# EAGLE design LiPo Rider Pro v0.9b (EAGLE 5.10)
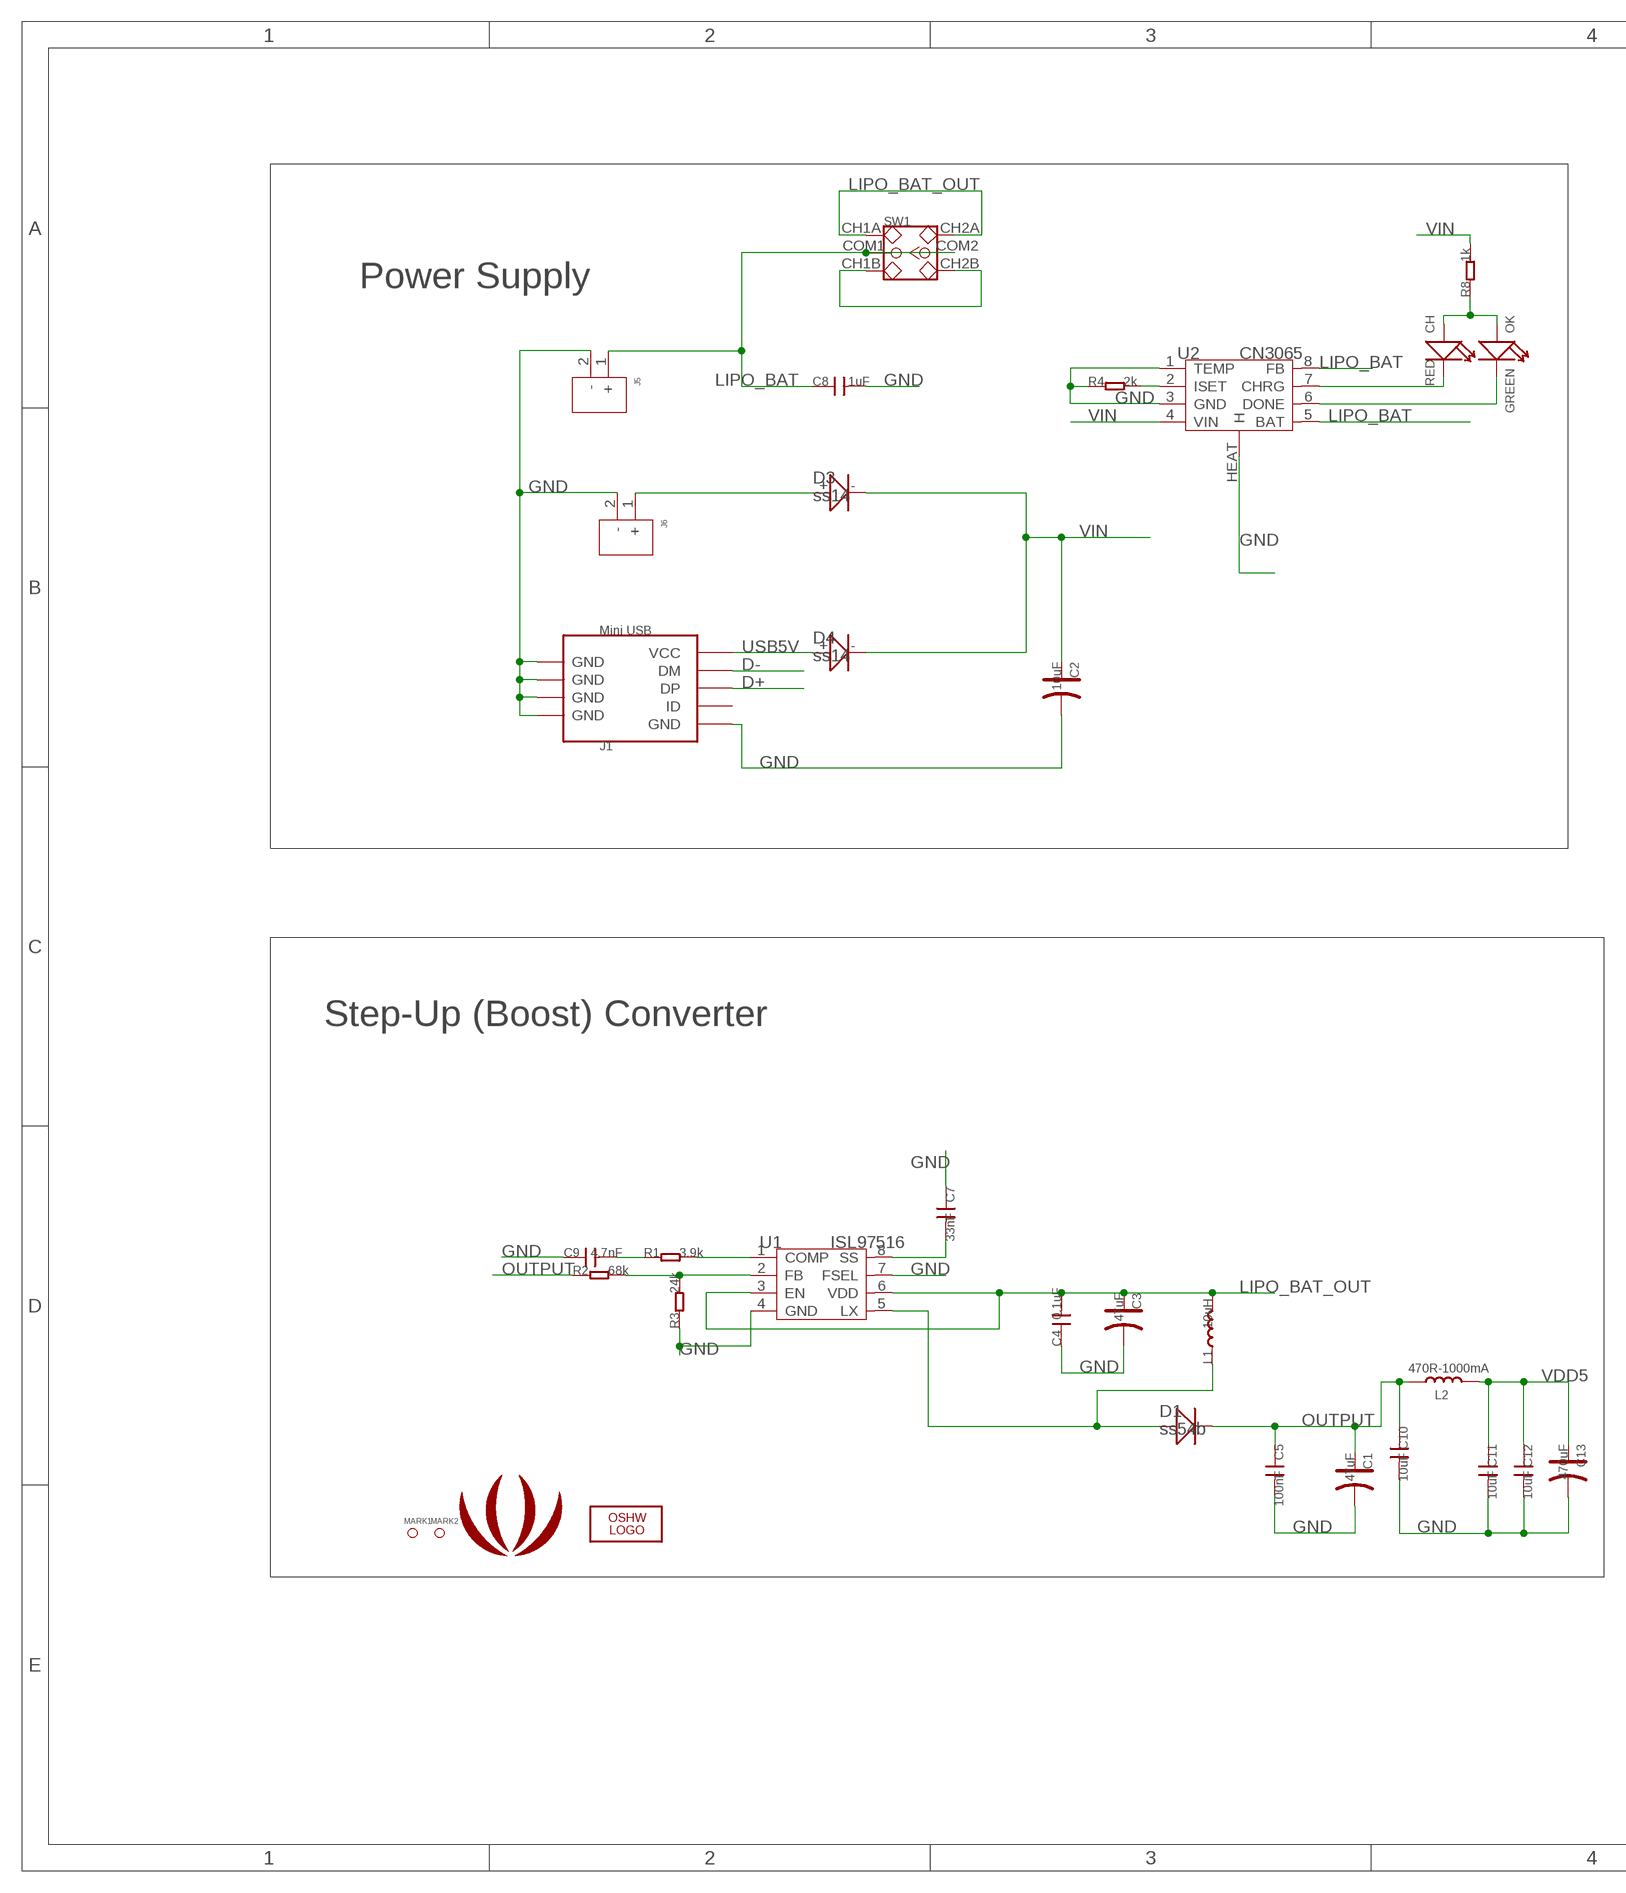
[diagram p0: schematic, sheet 1, part 1 of 2]
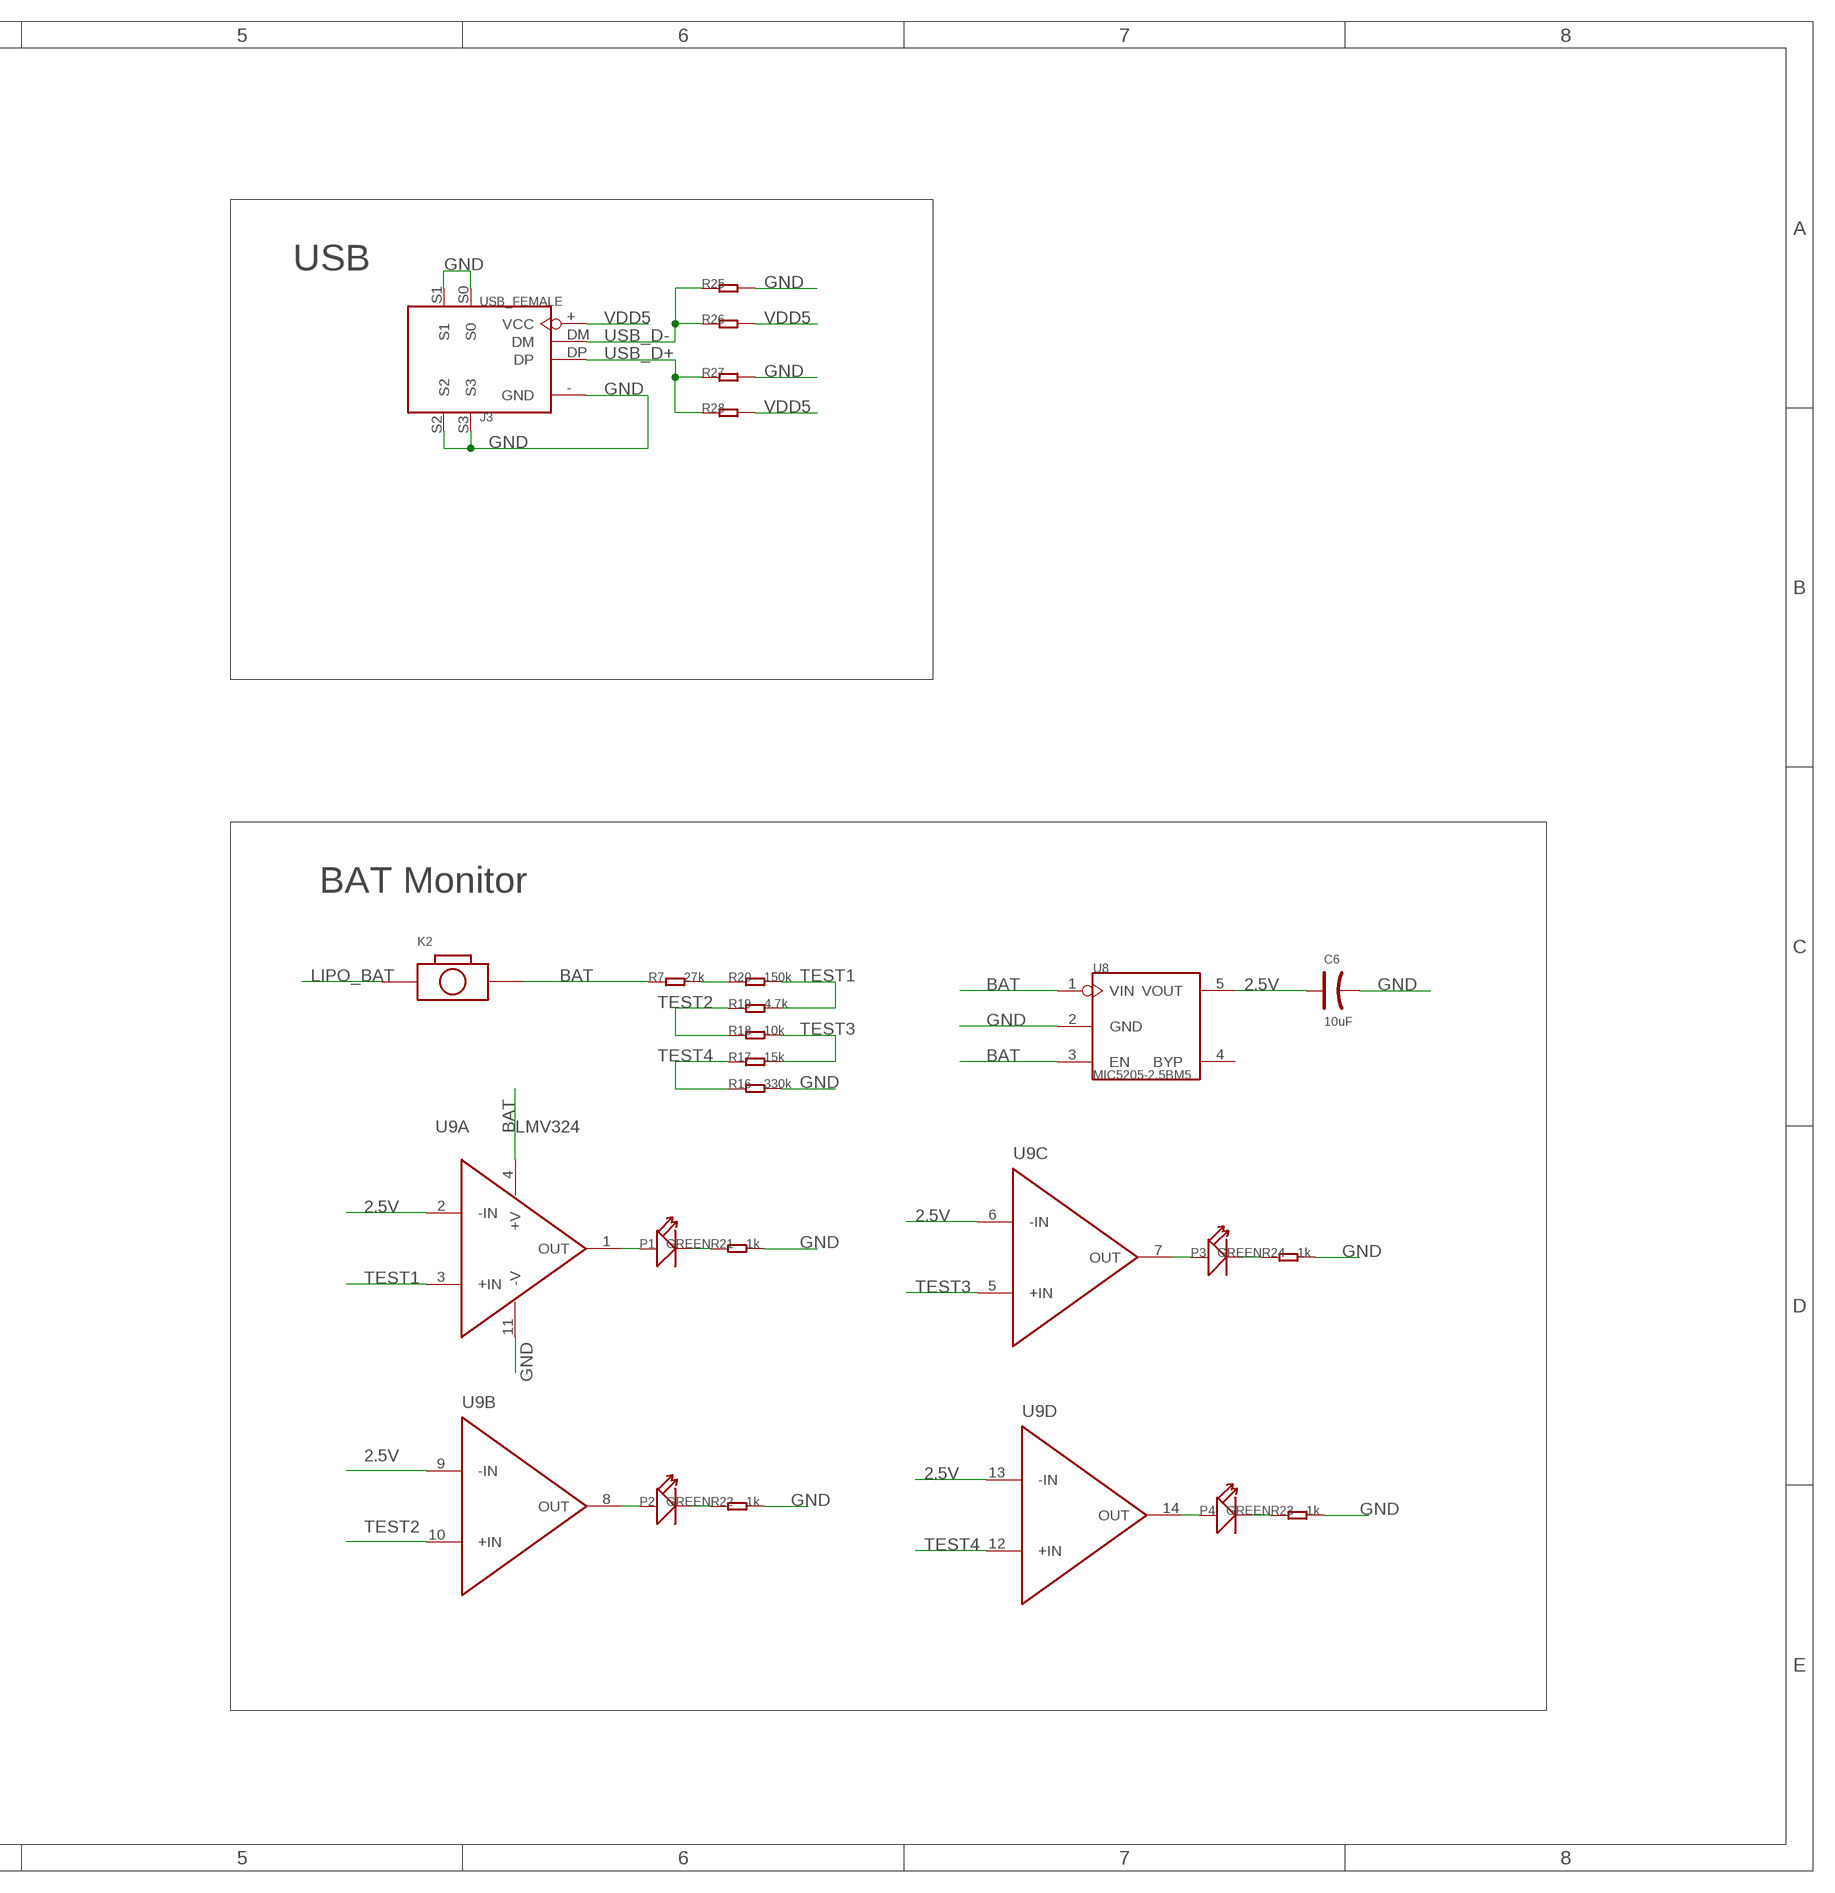
[diagram p1: schematic, sheet 1, part 2 of 2]

## Parts
C1  47uF  CAP_AVX_C  [AVX-C]
C2  10uF  CAP_AVX_B  [AVX-B]
C3  47uF  CAP_AVX_C  [AVX-C]
C4  0.1uF  C-0603  [0603]
C5  100nF  C-0603  [0603]
C6  10uF  CAP_AVX_B  [AVX-B]
C7  33nF  C-0603  [0603]
C8  1uF  C-0805  [0805]
C9  4.7nF  C-0603  [0603]
C10  10uF  C-0805  [0805]
C11  10uF  C-0805  [0805]
C12  10uF  C-0805  [0805]
C13  470uF  CAP_AVX_D  [AVX-D]
CH  RED  LED-0603  [D0603]
D1  ss54b  D-MBRS240LT3  [SMB]
D3  ss14  010-D2010  [D2010]
D4  ss14  010-D2010  [D2010]
J1  Mini USB  USB-MINIUSB-5P-STRONG  [MINI-5P]
J3  USB_FEMALE  USB-FEMALE-13.2X14.5  [FEMALE-13.2X14.5]
J5  JST-2P-POWER-SMD'2.0'  [2P-SMD-2.0-8X7.8]
J6  JST-2P-POWER-SMD'2.0'  [2P-SMD-2.0-8X7.8]
K2  BOTTON-2P-DIP  [2P-LEADED-90-3.56X7.62]
L1  10uH  L-PIO73  [PIO73]
L2  470R-1000mA  L0805  [0805]
LOGO1  LOGO-OSHW-FILLX0200-NT  [OSHW_FILLX200_NOTEXT]
MARK1  PAD-MARK  [ROUND-MARK-0.635]
MARK2  PAD-MARK  [ROUND-MARK-0.635]
OK  GREEN  LED-0603  [D0603]
P1  GREEN  LED-0603  [D0603]
P2  GREEN  LED-0603  [D0603]
P3  GREEN  LED-0603  [D0603]
P4  GREEN  LED-0603  [D0603]
R1  3.9k  R-0603  [0603]
R2  68k  R-0603  [0603]
R3  24k  R-0603  [0603]
R4  2k  R-0603  [0603]
R7  27k  R-0603  [0603]
R8  1k  R-0603  [0603]
R16  330k  R-0603  [0603]
R17  15k  R-0603  [0603]
R18  10k  R-0603  [0603]
R19  4.7k  R-0603  [0603]
R20  150k  R-0603  [0603]
R21  1k  R-0603  [0603]
R22  1k  R-0603  [0603]
R23  1k  R-0603  [0603]
R24  1k  R-0603  [0603]
R25  R-0204/5  [0204/5]
R26  R-0204/5  [0204/5]
R27  R-0204/5  [0204/5]
R28  R-0204/5  [0204/5]
SW1  SWITCH-2CH-6P'90'  [6P-LEADED-2CH-2.54-90-3.6X9.0]
U1  ISL97516  [MSOP8]
U2  CN3065  [DFN8]
U8  MIC5205-2.5BM5  MIC5025-SOT23-5  [SOT23-5]
U9  LMV324  [SO014]
U$1  LOGO-SEEEDSTUDIO-SILK  [LOGO_SILK]

## Nets
2.5V: C6.+ U8.5(VOUT) U9.2(A:-IN) U9.6(C:-IN) U9.9(B:-IN) U9.13(D:-IN)
BAT: K2.P$2 R7.1 U8.1(VIN) U8.3(EN) U9.4(A:+V)
CH: SW1.CH1B SW1.CH2B
D+: J1.3(DP)
D-: J1.2(DM)
GND: C1.- C2.- C3.- C4.1 C5.2 C6.- C7.1 C8.2 C9.1 C10.2 C11.2 C12.2 C13.- J1.5(GND) J1.GND@1(GND) J1.GND@2(GND) J1.GND@3(GND) J1.GND@4(GND) J3.-(GND) J3.S0 J3.S1 J3.S2 J3.S3 J5.2(-) J6.2(-) R3.1 R4.1 R16.2 R21.2 R22.2 R23.2 R24.2 R25.2 R27.2 U1.4(GND) U1.7(FSEL) U2.1(TEMP) U2.3(GND) U2.HEAT(H) U8.2(GND) U9.11(A:-V)
LIPO_BAT: C8.1 J5.1(+) K2.P$1 SW1.COM1 SW1.COM2 U2.5(BAT) U2.8(FB)
LIPO_BAT_OUT: C3.+ C4.2 L1.2 SW1.CH1A SW1.CH2A U1.3(EN) U1.6(VDD)
N$1: C7.2 U1.8(SS)
N$2: D1.+ L1.1 U1.5(LX)
N$3: D3.+ J6.1(+)
N$4: R1.2 U1.1(COMP)
N$5: C9.2 R1.1
N$6: R2.2 R3.2 U1.2(FB)
N$7: R4.2 U2.2(ISET)
N$8: CH.- U2.7(CHRG)
N$9: OK.- U2.6(DONE)
N$10: CH.+ OK.+ R8.1
N$20: R7.2 R20.1
N$25: P3.+ U9.7(C:OUT)
N$26: P4.+ U9.14(D:OUT)
N$28: P1.+ U9.1(A:OUT)
N$31: P2.+ U9.8(B:OUT)
N$33: P1.- R21.1
N$35: P2.- R22.1
N$36: P4.- R23.1
N$37: P3.- R24.1
OUTPUT: C1.+ C5.1 C10.1 D1.- L2.1 R2.1
TEST1: R19.2 R20.2 U9.3(A:+IN)
TEST2: R18.1 R19.1 U9.10(B:+IN)
TEST3: R17.2 R18.2 U9.5(C:+IN)
TEST4: R16.1 R17.1 U9.12(D:+IN)
USB5V: D4.+ J1.1(VCC)
USB_D+: J3.DP R27.1 R28.1
USB_D-: J3.DM R25.1 R26.1
VDD5: C11.1 C12.1 C13.+ J3.+(VCC) L2.2 R26.2 R28.2
VIN: C2.+ D3.- D4.- R8.2 U2.4(VIN)
Unconnected: J1.4(ID) U8.4(BYP)

## Notes on the sheet
- USB
- Power Supply
- BAT Monitor
- Step-Up (Boost) Converter

## Library data of the parts
C1 C3 C13 = Discrete:CAP*: Electrolytic Capacitors,Tantalum Capacitors and Super Capacitors
C2 C6 = Discreter:CAP*: Electrolytic Capacitors,Tantalum Capacitors and Super Capacitors
C4 C5 C7 C9-C12 = Discrete:C*: Ceramic Capacitors
C8 = Discreter:C*: Ceramic Capacitors
CH OK = Discrete:LED*
D1 = Discrete:D*
D3 D4 = Discrete:010-D*
J1 = Connector:USB-MINIUSB-5P
J3 = Connector:USB-FEMALE
J5 J6 = Connector:JST-2P-POWER-SMD
K2 = Discreter:BOTTON-2P
L1 L2 = Discrete:L*
LOGO1 = Logo:LOGO-OSHW-FILL
MARK1 MARK2 = Discreter:PAD-MARK
P1-P4 = Discreter:LED*
R1-R4 R8 R25-R28 = Discrete:R*
R7 R16-R24 = Discreter:R*
SW1 = Discrete:SWITCH-2CH-6P
U1 = IC:ISL97516
U2 = IC:CN3065
U8 = IC:MIC5025
U9 = IC (Miao Albert's conflicted copy 2011-05-27):LMV324
U$1 = Logo:LOGO-SEEEDSTUDIO

## Net classes
0 default: width 0.203 mm, drill 0.305 mm, clearance 0.127 mm

## Board
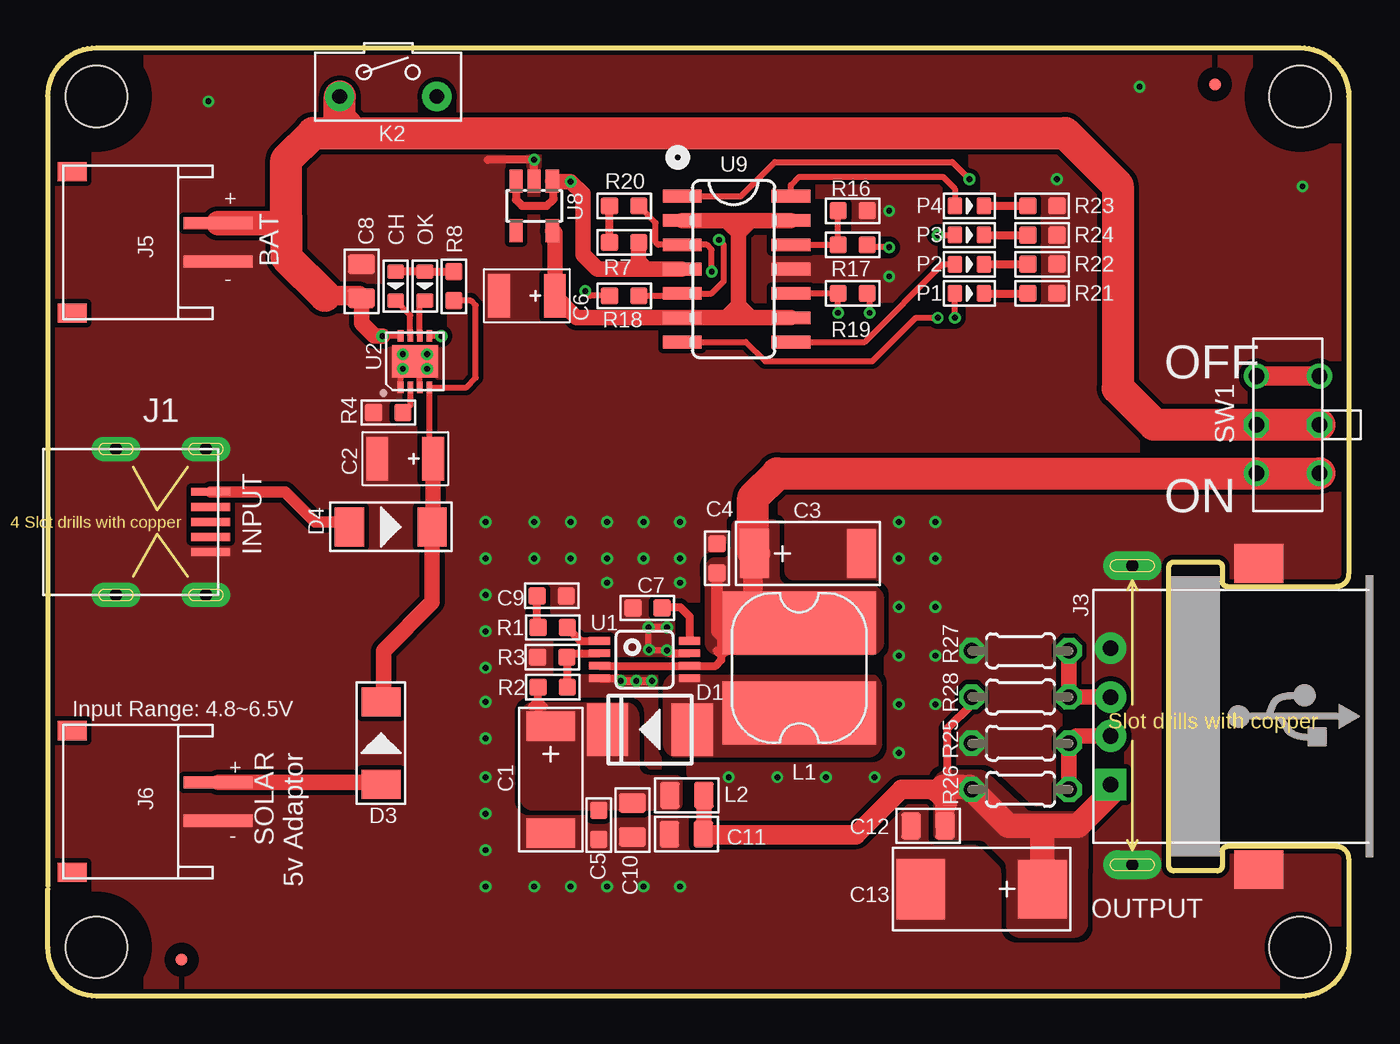
[diagram p2: board, top side]
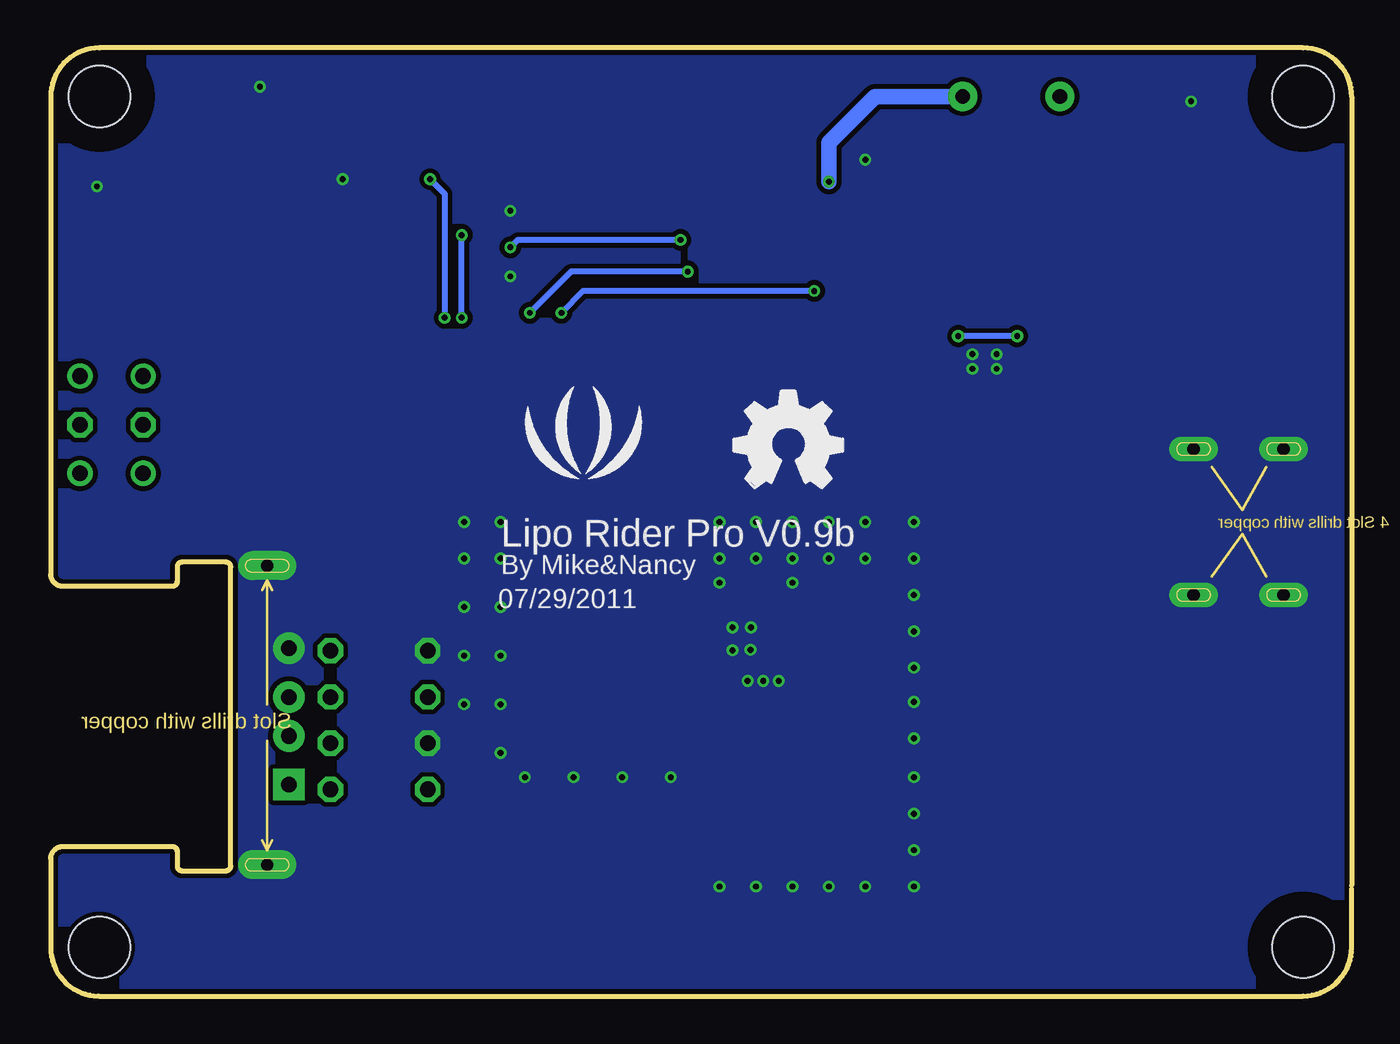
[diagram p3: board, bottom side, seen from below]

Size 67.94 x 49.53 mm. Coordinates in mm from the lower left corner, seen from the top.
Outline: 0,5.78 0,46.99 arc-90 2.54,49.53 65.41,49.53 arc-90 67.94,46.99 67.94,22.04 arc-90 67.31,21.4 61.59,21.4 arc-90 61.34,21.65 61.34,22.42 arc90 61.09,22.67 58.8,22.67 arc90 58.55,22.42 58.55,6.79 arc90 58.8,6.54 61.09,6.54 arc90 61.34,6.79 61.34,7.56 arc-90 61.59,7.81 67.31,7.81 arc-90 67.94,7.18 67.94,2.5 arc-90 65.44,0 2.54,0 arc-90 0,2.54 0,5.59
Copper layers (1*16): Top 0.035mm / dielectric 1.5mm / Bottom 0.035mm
Design rules "SeeedStudio_rule_no_angle_090911 *": minimum track width 6mil, minimum drill 12mil, track to track 6mil, track to pad 6mil, pad to pad 6mil, via to via 6mil, smd to smd 0mil, copper to edge 10mil, drill to drill 10mil, minimum pad ring 10mil, minimum via ring 6mil, stop-mask expansion 2mil, vias tented up to drill 25mil, thermal gap 10mil
Holes 3.2 mm at 2.54,46.99 2.54,2.54 65.41,46.99 65.41,2.54
tRestrict: area 0,44.5 to 5.1,49.5; area 62.9,44.5 to 67.9,49.5; area 0,0 to 5.1,5.1; area 35.6,17 to 43.4,17.6; area 35.2,17 to 35.8,17.2
bRestrict: area 62.9,44.5 to 67.9,49.5; area 0,0 to 5.1,5.1; area 0,44.5 to 5.1,49.5

### Footprints (pad centres in the part's own frame; a part is rotated, then mirrored left to right if it is on the bottom)
AVX-C = smd 1.524 x 2.54: + -2.794,0; - 2.794,0
AVX-B = smd 1.143 x 2.286: + -1.46,0; - 1.46,0
0603 = smd 0.889 x 0.889: 1 -0.762,0; 2 0.762,0
0805 = smd 1.016 x 1.397: 1 -0.889,0; 2 0.889,0
AVX-D = smd 2.54 x 3.048: + -3.175,0 | smd 2.54 x 3.175: - 3.175,0
D0603 = smd 0.762 x 0.889: + -0.762,0; - 0.762,0
SMB = smd 2.159 x 2.743: + 2.21,0; - -2.21,0
D2010 = smd 1.524 x 2.032: + -2.159,0; - 2.159,0
MINI-5P = smd 2.032 x 0.406: 1 0.381,-1.575; 2 0.381,-0.787; 3 0.381,0; 4 0.381,0.787; 5 0.381,1.575 | drill 0.635 pad 1.27 long: GND@1 0.635,3.81; GND@2 5.334,3.81; GND@3 5.334,-3.81; GND@4 0.635,-3.81
FEMALE-13.2X14.5 = drill 0.813 pad 1.651 square: + 0.889,-3.556 | drill 0.813 pad 1.651 round: - 0.889,3.556; DM 0.889,-1.016; DP 0.889,1.016 | smd 2.54 x 2.032: S0 8.636,8.001; S3 8.636,-8.001 | drill 0.635 pad 1.524 long: S1 2.032,7.874; S2 2.032,-7.747
2P-SMD-2.0-8X7.8 = smd 0.635 x 3.6: 1 -1,5.08; 2 1,5.08 | smd 1 x 1.5: P$1 -3.7,-2.54; P$2 3.7,-2.54
2P-LEADED-90-3.56X7.62 = drill 0.762 pad 1.524 round: P$1 0,2.54; P$2 0,-2.54
PIO73 = smd 8 x 3.3: 1 0,2.35; 2 0,-2.35
ROUND-MARK-0.635 = smd 0.635 x 0.635: P$1 0,0
0204/5 = drill 0.813 octagon: 1 -2.54,0; 2 2.54,0
6P-LEADED-2CH-2.54-90-3.6X9.0 = drill 0.813 pad 1.27 round: CH1A -2.54,-1.65; CH1B 2.54,-1.65; CH2A -2.54,1.65; CH2B 2.54,1.65 | drill 0.813 pad 1.27 octagon: COM1 0,-1.65; COM2 0,1.65
MSOP8 = smd 0.4 x 1.1: 1 -0.975,-2.35; 2 -0.325,-2.35; 3 0.325,-2.35; 4 0.975,-2.35; 5 0.975,2.35; 6 0.325,2.35; 7 -0.325,2.35; 8 -0.975,2.35
DFN8 = smd 0.3 x 0.6: 1 -0.75,-1.35; 2 -0.25,-1.35; 3 0.25,-1.35; 4 0.75,-1.35; 5 0.75,1.35; 6 0.25,1.35; 7 -0.25,1.35; 8 -0.75,1.35 | smd 2.4 x 1.7: HEAT 0,0
SOT23-5 = smd 0.69 x 1.2: 1 -0.95,-1.3; 2 0,-1.3; 3 0.95,-1.3; 4 0.95,1.3; 5 -0.95,1.3
SO014 = smd 0.66 x 2.032: 1 -3.175,-2.68; 2 -1.905,-2.68; 3 -0.635,-2.68; 4 0.635,-2.68; 5 1.905,-2.68; 6 3.175,-2.68; 7 4.445,-2.68; 8 4.445,2.997; 9 3.175,2.997; 10 1.905,2.997; 11 0.635,2.997; 12 -0.635,2.997; 13 -1.905,2.997; 14 -3.175,2.997

### Placement (x,y rotation side)
C1  26.26,11.3 270 top
C2  18.67,28.07 180 top
C3  39.7,23.11 0 top
C4  34.95,22.86 270 top
C5  28.78,8.94 270 top
C6  25.02,36.58 180 top
C7  31.32,20.27 0 top
C8  16.38,37.34 90 top
C9  26.31,20.9 180 top
C10  30.53,9.19 270 top
C11  33.35,8.46 180 top
C12  45.97,8.89 180 top
C13  48.77,5.59 180 top
CH  18.16,37.08 270 top
D1  31.45,13.92 0 top
D3  17.4,13.21 90 top
D4  17.91,24.51 0 top
J1  8.89,24.77 180 top
J3  54.61,14.61 0 top
J5  3.81,39.37 270 top
J6  3.81,10.16 270 top
K2  17.78,46.99 90 top
L1  39.24,17.14 180 top
L2  33.38,10.49 0 top
LOGO1  32.26,26.54 0 bottom
MARK1  6.99,1.91 0 top
MARK2  60.96,47.62 0 top
OK  19.68,37.08 270 top
P1  48.13,36.7 0 top
P2  48.13,38.23 0 top
P3  48.13,39.75 0 top
P4  48.13,41.27 0 top
R1  26.37,19.25 0 top
R2  26.37,16.13 0 top
R3  26.34,17.7 0 top
R4  17.78,30.48 0 top
R7  30.1,39.37 180 top
R8  21.21,37.08 270 top
R16  42.04,41.02 0 top
R17  42.04,39.24 0 top
R18  30.1,36.58 0 top
R19  42.04,36.7 0 top
R20  30.1,41.27 0 top
R21  51.94,36.7 0 top
R22  51.94,38.23 0 top
R23  51.94,41.27 0 top
R24  51.94,39.75 0 top
R25  50.8,13.21 180 top
R26  50.8,10.79 180 top
R27  50.8,18.03 180 top
R28  50.8,15.62 180 top
SW1  64.77,29.84 90 top
U1  31.17,17.58 270 top
U2  19.18,33.15 0 top
U8  25.4,41.27 180 top
U9  35.81,38.61 270 top
U$1  40.13,28.7 0 bottom

### Tracks (layer width: path | path; a pad name or v marks a point on that pad's centre or on a via)
2.5V
  Top 0.813: U8.5 26.48,39.84 C6.+ 27.62,35.43 U9.6 35.43,35.43 | 36.07,35.43 36.7,35.43 | 36.7,35.43 U9.9 | 36.07,40.51 U9.2 | 36.07,40.51 U9.13 | 35.43,35.43 36.07,35.43 | 36.07,35.43 36.07,36.07 | 36.07,39.88 36.07,40.51 | 36.07,39.88 35.56,40.39 | 36.07,39.88 36.58,40.39 | 36.07,36.07 36.7,35.43 | 36.07,36.07 36.07,39.88 | 35.43,35.43 36.07,36.07
BAT  (via drill 0.3 pad 0.61)
  Top 0.406: U8.3 24.45,41.59 24.77,41.27 26.06,41.27 26.42,41.63 26.42,42.51 U8.1
  Top 0.813: 30.48,37.97 28.7,37.97 27.94,38.73 27.94,41.91 v27.3,42.55 26.38,42.55 U8.1 | 30.48,37.97 U9.4 | 30.86,38.35 R7.1 | 30.86,38.35 31.11,38.1 | 30.48,37.97 30.86,38.35
  Bottom 0.813: K2.P$2 24.89,46.99 27.3,44.58 v27.3,42.55
CH
  Top 1.016: SW1.CH2B SW1.CH1B
GND  (via drill 0.3)
  Top 0.305: U2.3 19.43,32.38 v19.81,32.77 | U2.1 18.43,32.65 v18.54,32.77 | v32.33,18.06 31.39,18.06 31.37,18.03 31.37,19.3 32.26,19.3 32.38,19.18
  Top 0.406: U8.2 v25.4,43.69 22.99,43.69 | 32.99,17.9 U1.7 | v32.33,18.06 32.49,17.9 32.99,17.9 | 32.99,17.9 32.99,17.91 32.77,17.91 | U1.4 29.78,16.6 v29.92,16.46 30.68,16.46 30.73,16.51 | v30.73,16.46 31.45,16.46 31.5,16.51
  other vias: 52.7,42.67 43.94,41.02 43.94,37.59 65.53,42.29 8.38,46.74 57.02,47.5 22.86,11.43 22.86,13.46 22.86,15.37 22.86,19.05 22.86,9.53 22.86,7.62 22.86,20.95 31.39,18.08 22.86,17.14 22.86,5.71 25.4,5.71 27.3,5.71 29.21,5.71 33.02,5.71 31.11,5.71 22.86,22.86 25.4,22.86 27.3,22.86 29.21,22.86 31.11,22.86 33.02,22.86 33.02,21.59 29.21,21.59 33.02,24.77 31.11,24.77 29.21,24.77 27.3,24.77 25.4,24.77 22.86,24.77 44.45,24.77 44.45,22.86 44.45,20.32 44.45,17.78 44.45,15.24 44.45,12.7 46.35,24.77 46.35,15.24 46.35,17.78 46.35,20.32 46.35,22.86 32.33,19.25 31.37,19.25 31.55,16.46 18.54,33.53 19.81,33.53 35.56,11.43 38.1,11.43 40.64,11.43 43.18,11.43
  pour Bottom: -6.99,48.26 -5.71,48.26 -5.71,46.99 -6.99,46.99
  pour Top (isolate 0.254, rank 5, no thermals): -1.27,50.16 70.48,50.16 70.48,-1.27 -1.27,-1.27
  pour Bottom (isolate 0.254, rank 5, no thermals): -1.27,50.16 70.48,50.16 70.48,-1.27 -1.27,-1.27
LIPO_BAT  (via drill 0.3 pad 0.64)
  Top 0.305: v20.55,34.47 20,34.47 arc-45 U2.5 | U2.8 17.8,34.5 arc45 v17.48,34.47
  Top 0.406: SW1.COM1
  Top 0.813: v17.48,34.47 17.07,34.47 16.38,35.15 C8.1
  Top 1.016: 14.48,36.58 16.26,36.58 C8.1
  Top 1.27: J5.1 12.18,40.37 12.45,40.64
  Top 1.676: 15.24,45.72 K2.P$1 | 15.24,45.72 15.24,45.62 14.71,45.09 | 15.24,45.72 15.37,45.72 16,45.09 | 14.71,45.09 16,45.09 | 16,45.09 53.13,45.09 55.88,42.34 55.88,31.75 57.78,29.84 SW1.COM2 SW1.COM1 | 14.71,45.09 13.84,45.09 12.45,43.69 12.45,40.64 12.45,38.61 14.48,36.58
  Bottom 0.305: v17.48,34.47 v20.55,34.47
LIPO_BAT_OUT
  Top 0.406: U1.3 U1.6 34.89,17.25 35.18,17.55 35.18,17.78 | L1.2 38.92,19.18 36.58,19.18 | 35.18,17.78 35.18,18.8 | 36.58,19.18 35.43,19.18 35.12,18.86 35.05,18.8 36.2,18.8 36.58,19.18 | 35.18,17.78 35.05,17.91 | 35.05,17.91 34.92,18.03 | 35.18,17.78 35.43,18.03 | 38.73,19.05 36.2,19.05 35.05,17.91
  Top 0.61: C4.2 34.95,19.02 35.12,18.86 38.54,18.86 38.73,19.05 | 36.58,19.18 36.58,19.43 36.83,19.68
  Top 1.016: 36.83,19.68 36.83,23.19
  Top 1.676: C3.+ 36.83,23.19 36.83,26.04 38.1,27.3 SW1.CH2A SW1.CH1A
  pour Top (isolate 0.254, no thermals): 43.56,20.7 arc90 42.93,21.34 38.73,21.34 arc-90 38.1,21.97 38.1,24.51 arc90 37.85,24.77 36.07,24.77 arc90 35.81,24.51 35.81,23.5 arc-90 35.18,22.86 35.05,22.86 arc90 34.42,22.23 34.42,18.54 arc90 35.05,17.91 42.93,17.91 arc90 43.56,18.54
  pour Top (isolate 0.254, no thermals): 43.56,20.7 arc90 42.93,21.34 38.73,21.34 arc-90 38.1,21.97 38.1,24.51 arc90 37.85,24.77 36.07,24.77 arc90 35.81,24.51 35.81,23.5 arc-90 35.18,22.86 35.05,22.86 arc90 34.42,22.23 34.42,18.54 arc90 35.05,17.91 42.93,17.91 arc90 43.56,18.54
N$1
  Top 0.406: U1.8 33.52,19.82 33.02,20.32 32.13,20.32 C7.2
N$2
  pour Top (isolate 0.254, no thermals): 32.89,12.57 arc-90 32.26,13.21 32.26,16.13 arc-90 32.89,16.76 42.8,16.76 arc-90 43.43,16.13 43.43,13.21 arc-90 42.8,12.57
N$3
  Top 0.813: J6.1 17.29,11.16 D3.+
N$4
  Top 0.406: U1.1 27.83,18.55 R1.2
N$5
  Top 0.406: C9.2 25.55,19.3 R1.1
N$6
  Top 0.406: U1.2 27.3,17.9 R3.2 27.13,17.68 R2.2
N$7
  Top 0.305: U2.2 18.93,30.86 R4.2
N$8
  Top 0.305: U2.7 18.93,35.56 CH.-
N$9
  Top 0.305: U2.6 19.43,36.06 OK.-
N$10
  Top 0.406: CH.+ OK.+ R8.1
N$20
  Top 0.406: R7.2 R20.1
N$25  (via drill 0.3 pad 0.61)
  Top 0.305: U9.7 36.45,34.16 37.46,33.16 43.06,33.16 45.34,35.43 v46.48,35.43 | v46.48,39.75 P3.+
  Bottom 0.305: v46.48,35.43 v46.48,39.75
N$26
  Top 0.305: U9.14 38.81,42.37 39.24,42.8 46.74,42.8 47.37,42.16 P4.+
N$28  (via drill 0.3 pad 0.61)
  Top 0.305: U9.1 36.2,41.78 37.97,43.56 47.24,43.56 v48.13,42.67 | v47.37,35.43 P1.+
  Bottom 0.305: v47.37,35.43 47.37,41.91 v48.13,42.67
N$31
  Top 0.305: U9.8 42.66,34.16 46.73,38.23 P2.+
N$33
  Top 0.406: P1.- R21.1
N$35
  Top 0.406: P2.- R22.1
N$36
  Top 0.406: P4.- R23.1
N$37
  Top 0.406: P3.- R24.1
OUTPUT
  Top 0.254: C1.+ 25.83,14.1 arc-90 25.58,14.35 25.58,14.38 arc90 25.6,14.4 25.6,15.44 | 25.58,15.44 arc-90 25.6,15.42 25.6,14.38
  Top 0.406: 25.6,15.44 25.6,14.38 | 25.6,15.44 R2.1 | 25.27,15.11 25.6,15.44 | 25.58,15.44 25.91,15.11
  pour Top (isolate 0.254, no thermals): 25.4,9.8 arc-90 24.77,10.44 24.77,14.61 arc-90 25.4,15.24 30.12,15.24 arc-90 30.76,14.61 30.76,12.06 arc90 31.39,11.43 32.77,11.43 arc-90 33.02,11.18 33.02,10.06 arc-90 32.77,9.8
TEST1  (via drill 0.3 pad 0.61)
  Top 0.305: R20.2 31.75,40.39 31.75,39.37 31.88,39.24 U9.3 34.42,39.24 34.67,38.99 v34.67,37.85 | v42.93,35.69 42.93,36.58 R19.2
  Bottom 0.305: v34.67,37.85 40.77,37.85 v42.93,35.69
TEST2  (via drill 0.3 pad 0.61)
  Top 0.305: R18.1 28.32,36.58 v28.07,36.83 | v41.27,35.69 R19.1 U9.10
  Bottom 0.305: v28.07,36.83 40.13,36.83 v41.27,35.69
TEST3  (via drill 0.3 pad 0.61)
  Top 0.305: R18.2 33.01,36.58 U9.5 34.67,36.7 35.31,37.34 35.31,39.24 v35.05,39.5 | v43.94,39.12 42.93,39.12 R17.2
  Bottom 0.305: v35.05,39.5 43.56,39.5 v43.94,39.12
TEST4
  Top 0.305: U9.12 R17.1 R16.1
USB5V
  Top 0.406: 15.49,24.77 D4.+
  Top 0.61: J1.1 12.39,26.34 13.97,24.77 15.49,24.77
USB_D+
  Top 0.813: J3.DP R28.1 R27.1
USB_D-
  Top 0.813: J3.DM 53.72,13.59 R25.1 R26.1
VDD5
  Top 0.406: 47.5,10.92 47.75,10.92 48.13,10.92 | R28.2 48.26,15.24 46.99,13.97 46.99,10.92
  Top 0.813: L2.2 34.27,8.48 C11.1
  Top 1.016: 46.86,10.79 C12.1 | 46.86,10.79 46.74,10.92 | 45.97,10.79 46.86,10.79 | C11.1 arc45 34.3,8.43 42.22,8.43 44.58,10.79 45.97,10.79 | 45.97,10.79 arc-45 46.41,10.61 46.99,10.03
  Top 1.27: 51.56,8.89 50.16,8.89 R26.2 48.13,10.92 | 51.56,8.89 53.79,8.89 55.5,10.6 J3.+ | 46.74,10.92 46.99,10.92 47.75,10.92 | C13.+ 51.94,8.51 51.56,8.89
  pour Top (isolate 0.254, rank 3, no thermals): -6.99,45.72 -5.71,45.72 -5.71,44.45 -6.99,44.45
  pour Top (no thermals): 50.16,3.81 arc90 50.8,3.17 53.57,3.17 arc90 54.2,3.81 54.23,9.53 51.43,9.53 arc-43 51,9.7 49.08,11.51 arc43 48.64,11.68 46.99,11.68 arc90 46.35,11.05 46.35,8.51 arc90 46.61,8.26 48.63,8.26 arc-45 49.08,8.07 49.98,7.17 arc-45 50.16,6.72
VIN
  Top 0.305: R8.2 22.1,36.32 22.35,36.07 22.35,32.3 21.84,31.8 U2.4 19.93,28.27 C2.+
  Top 0.813: C2.+ 20.13,24.57 D4.- 20.07,20.57 17.53,18.03 17.53,15.49 D3.-

### Text on the board
tPlace: + | BAT | - | OFF | ON | Input Range: 4.8~6.5V | + | - | SOLAR | 5v Adaptor
bPlace: Lipo Rider Pro V0.9b | By Mike&Nancy | 07/29/2011
tNames: INPUT | OUTPUT